# EasyEDA schematic RaneFFboard.json
TITLE: Sheet_1; REV: 1.0; Date: 2022-08-05; Sheet: 1/1; Company: Your Company
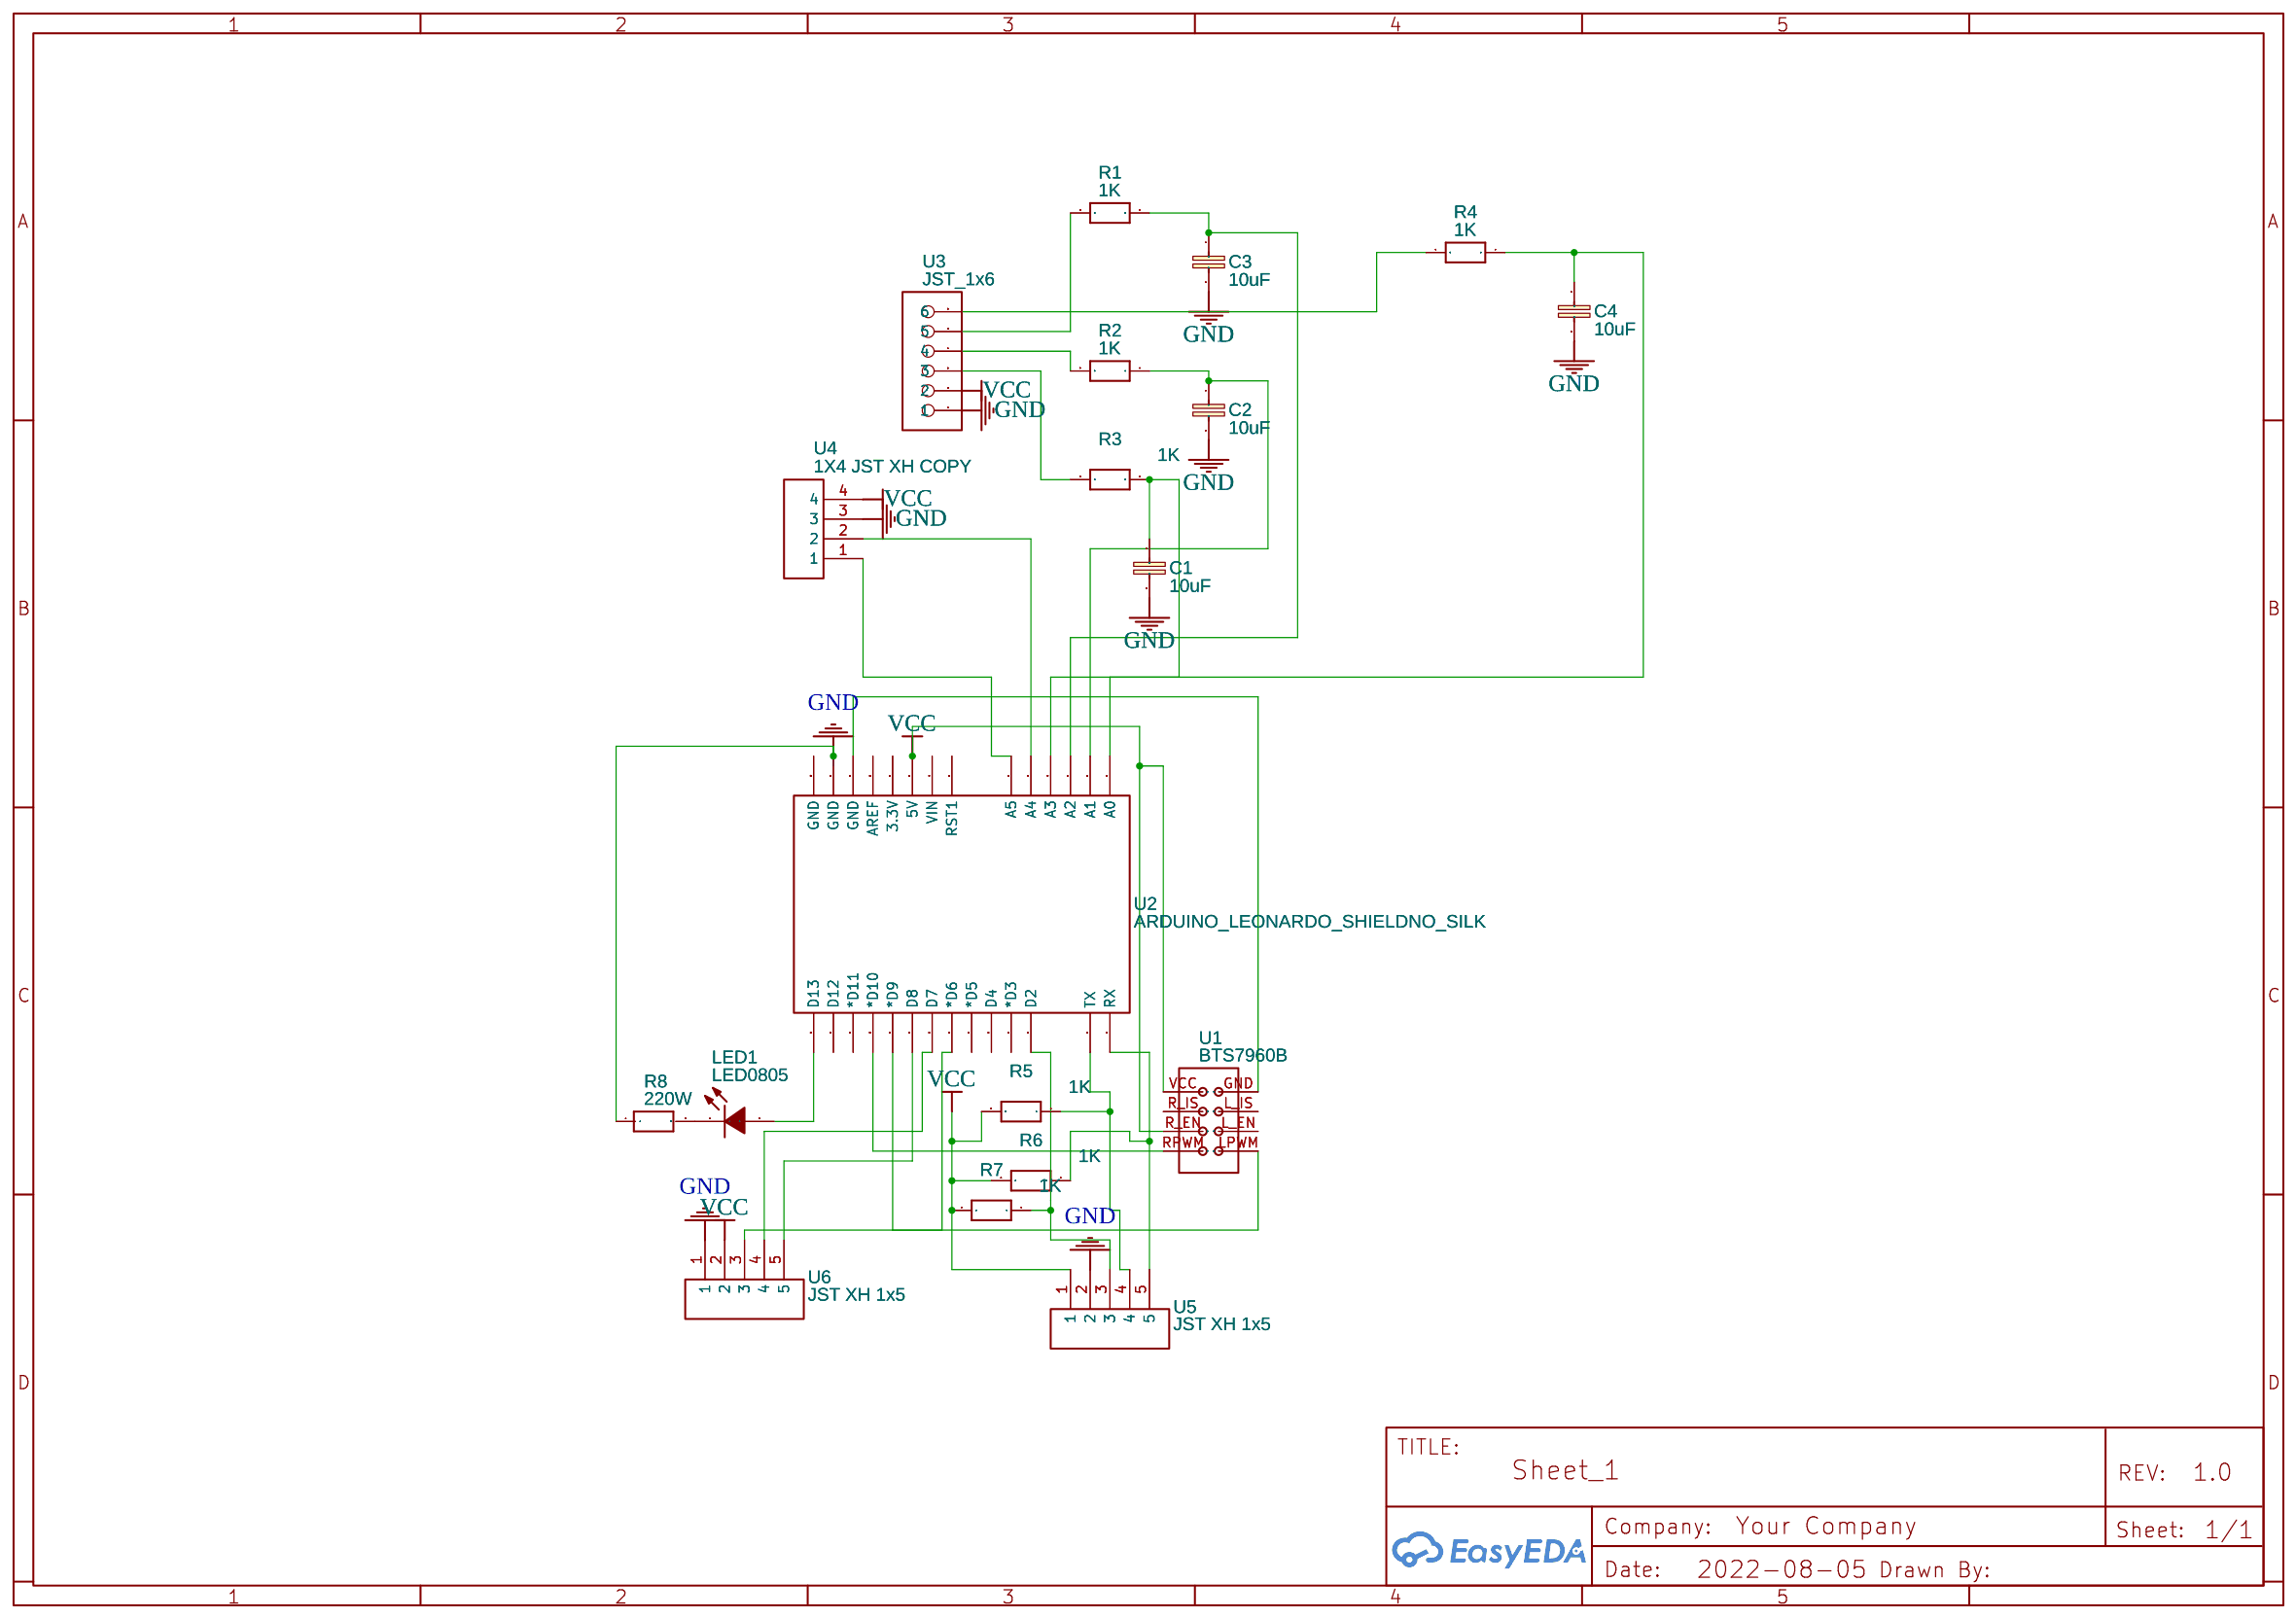
[diagram p0: schematic sheet]

## Parts
C1  10uF  [C2012]
C2  10uF  [C2012]
C3  10uF  [C2012]
C4  10uF  [C2012]
LED1  LED0805  [LED0805-RD]
R1  1K  [2012]
R2  1K  [2012]
R3  1K  [2012]
R4  1K  [2012]
R5  1K  [2012]
R6  1K  [2012]
R7  1K  [2012]
R8  220W  [2012]
U1  BTS7960B  [BTS7960B]
U2  ARDUINO_LEONARDO_SHIELDNO_SILK  [ARDUINO_LEONARDO_SHIELD]
U3  JST_1x6  [JST XH 1X6]
U4  1X4 JST XH COPY  [1X4 JST XH]
U5  JST XH 1x5  [JST XH 1X5]
U6  JST XH 1x5  [JST XH 1X5]

## Library data of the parts
C1-C4 = C-EUC2012: Contributor: Marlon Otto
LED1 = LED0805: Supplier: LCSC; Supplier Part: C9900012722; Manufacturer: null; Manufacturer Part: led0805; Contributor: LCSC; JLCPCB Part Class: Extended Part
R1-R8 = RESISTOR2012: Contributor: eco748
U1 = BTS7960B: Contributor: taha.satoglu
U2 = ARDUINO_LEONARDO_SHIELDNO_SILK: Contributor: Hansms
U3 = JST_1x6: Contributor: papaco; Package Display: No
U4 = 1X4 JST XH COPY: Contributor: edelarosar1700
U5 U6 = JST XH 1x5: Contributor: GeMeMe

## Nets
GND: C1.2 C2.2 C3.2 C4.2 R8.1 U1.GND(4) U2.GND1(GND) U3.1 U4.3 U5.2 U6.1
VCC: R5.2 R6.2 R7.2 U1.R_EN(3) U1.VCC(1) U2.5V U3.2 U4.4 U5.1 U6.2
Net-(C1-1): C1.1 R3.1 U2.A0
Net-(C2-1): C2.1 R2.1 U2.A1
Net-(C3-1): C3.1 R1.1 U2.A2
Net-(C4-1): C4.1 R4.1 U2.A3
Net-(LED1-1): LED1.1(-) R8.2
Net-(LED1-2): LED1.2(+) U2.D13
Net-(R1-2): R1.2 U3.5
Net-(R2-2): R2.2 U3.4
Net-(R3-2): R3.2 U3.3
Net-(R4-2): R4.2 U3.6
Net-(R5-1): R5.1 U2.D1(TX) U5.4
Net-(R6-1): R6.1 U2.D0(RX) U5.5
Net-(R7-1): R7.1 U2.D2 U5.3
Net-(U1-LPWM): U1.LPWM(1) U2.D9(*D9)
Net-(U1-RPWM): U1.RPWM(4) U2.D10(*D10)
Net-(U2-A4): U2.A4 U4.2
Net-(U2-A5): U2.A5 U4.1
Net-(U2-D6): U2.D6(*D6) U6.3
Net-(U2-D7): U2.D7 U6.4
Net-(U2-D8): U2.D8 U6.5

Not connected (* = marked no-connect by the designer): U1 L_EN(2) L_IS(3) R_IS(2); U2 3.3V AREF D3(*D3) D4 D5(*D5) D11(*D11) D12 GND2(GND) RST1 VIN
